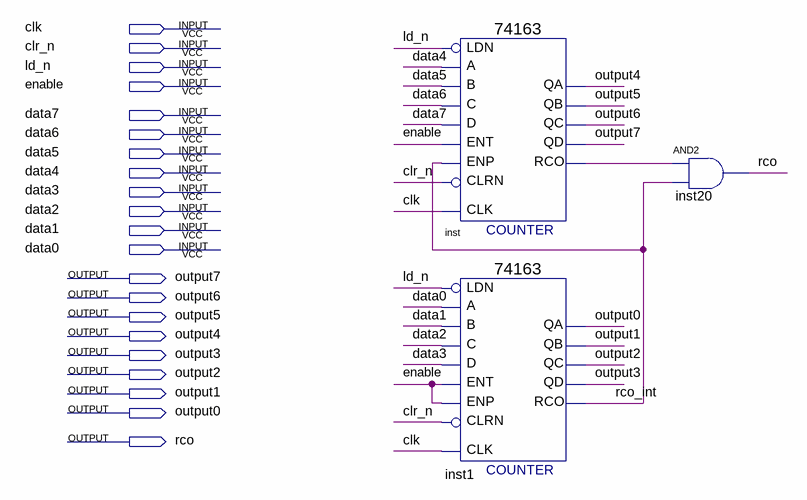
[diagram p0: schematic sheet]
// Quartus schematic counter.bdf as structural Verilog: 3 symbols, 21 pins
module counter (
  input  clk,
  input  clr_n,
  input  ld_n,
  input  enable,
  input  data7,
  input  data6,
  input  data5,
  input  data4,
  input  data3,
  input  data2,
  input  data1,
  input  data0,
  output output7,
  output output6,
  output output5,
  output output4,
  output output3,
  output output2,
  output output1,
  output output0,
  output rco
);

  wire inst_rco, rco_int;

  \74163  inst (
    .C(data6), .B(data5), .A(data4), .ENT(enable), .D(data7), .CLRN(clr_n), .CLK(clk), .ENP(rco_int),
    .LDN(ld_n), .QA(output4), .QB(output5), .QC(output6), .QD(output7), .RCO(inst_rco));
  \74163  inst1 (
    .C(data2), .B(data1), .A(data0), .ENT(enable), .D(data3), .CLRN(clr_n), .CLK(clk), .ENP(enable),
    .LDN(ld_n), .QA(output0), .QB(output1), .QC(output2), .QD(output3), .RCO(rco_int));
  and inst20 (rco, inst_rco, rco_int);
endmodule
